# Altium project IOT_20232.PrjPcb
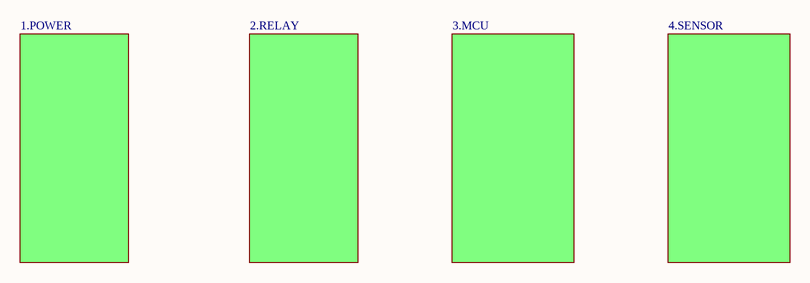
[diagram p0: GEN.SchDoc]
5 sheets, 63 parts. Net scope: global (net labels, ports and power ports of the same name join across sheets).
Board file: IOT.PcbDoc
Sheets:
  GEN.SchDoc
    Designator = 1.POWER.SchDoc
    Designator = 2.RELAY.SchDoc
    Designator = 3.MCU.SchDoc
    Designator = 4.SENSOR.SchDoc

## Sheet GEN.SchDoc
size A4; SheetNumber: 1; SheetTotal: 5

### Sub-sheets
Designator = 1.POWER: no entries
Designator = 2.RELAY: no entries
Designator = 3.MCU: no entries
Designator = 4.SENSOR: no entries

## Sheet 1.POWER.SchDoc
size A4; SheetNumber: 5; SheetTotal: 5
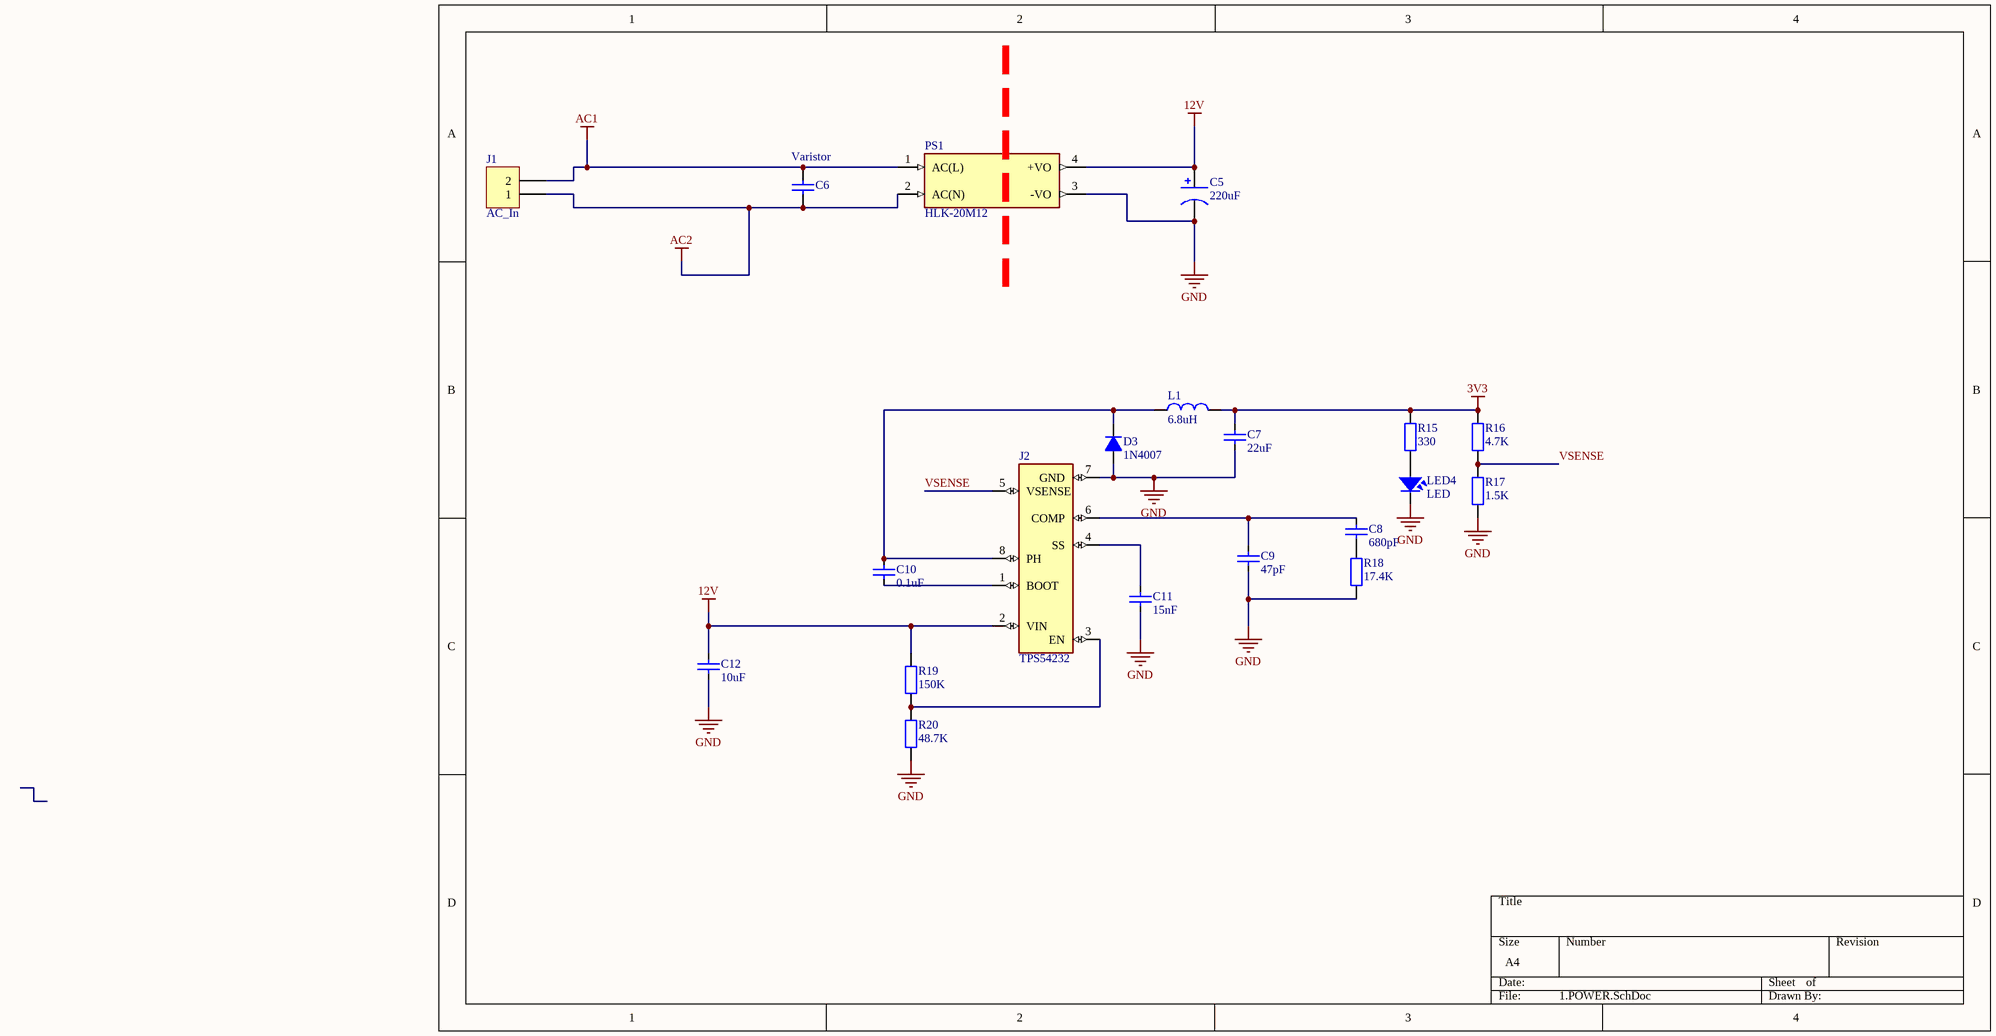
[diagram p1: 1.POWER.SchDoc]

### Parts
C5  220uF  [C3MM]
C6  Varistor  [CAP_CERAMIC]
C7  22uF  [CAP_0805]
C8  680pF  [CAP_0805]
C9  47pF  [CAP_0805]
C10  0.1uF  [CAP_0805]
C11  15nF  [CAP_0805]
C12  10uF  [CAP_0805]
D3  1N4007  [DIO-214AC(SMA)]
J1  AC_In  [KF2-5.08T]
J2  TPS54232  [SOIC8]
L1  6.8uH  [L-SMD-M-12x10]
LED4  LED  [LED_RED_SMD_0805]
PS1  HLK-20M12  [CONV_HLK-20M12]
R15  330  [RES-SMD-0805]
R16  4.7K  [RES-SMD-0805]
R17  1.5K  [RES-SMD-0805]
R18  17.4K  [RES-SMD-0805]
R19  150K  [RES-SMD-0805]
R20  48.7K  [RES-SMD-0805]

### Nets
3V3: C7.1 L1.2 R15.2 R16.2
12V: C5.1 C12.1 J2.2(VIN) PS1.4(+VO) R19.2
AC1: C6.1 J1.2 PS1.1(AC(L))  [project net COM1]
AC2: C6.2 J1.1 PS1.2(AC(N))
GND: C5.2 C7.2 C9.2 C11.2 C12.2 D3.1(A) J2.7(GND) LED4.2 PS1.3(-VO) R17.1 R18.1 R20.1
VSENSE: J2.5(VSENSE) R16.1 R17.2
NetC8_1: C8.1 C9.1 J2.6(COMP)
NetC8_2: C8.2 R18.2
NetC10_1: C10.1 D3.2(K) J2.8(PH) L1.1
NetC10_2: C10.2 J2.1(BOOT)
NetC11_1: C11.1 J2.4(SS)
NetJ2_3: J2.3(EN) R19.1 R20.2
NetLED4_1: LED4.1 R15.1

### Library data of the parts
C5 = Cap Pol: Polarized Capacitor (Axial); Published: 8-Jun-2000; LatestRevisionDate: 17-Jul-2002; LatestRevisionNote: Re-released for DXP Platform.; PackageReference: POLAR0.8; Publisher: Altium Limited
C6 = CapCeramic: Capacitor; Value: 33p; Published: 8-Jun-2000; LatestRevisionDate: 17-Jul-2002; LatestRevisionNote: Re-released for DXP Platform.; PackageReference: RAD-0.3; Publisher: Altium Limited
C7-C12 = CapSMD: Capacitor; Value: 33p; Published: 8-Jun-2000; LatestRevisionDate: 17-Jul-2002; LatestRevisionNote: Re-released for DXP Platform.; PackageReference: RAD-0.3; Publisher: Altium Limited
D3 = D1A: Diode 1A; Value: 1N4007
J1 = KF2: Manufacturer: Würth Elektronik eiSos GmbH; partNo: 691103110002; ComponentLink1 Description: Manufacturer; ComponentLink2 Description: Datasheet; NoPins: 2; Created Date: 29 October 2013; ComponentLink1URL: http://www.we-online.com; ComponentLink2URL: http://katalog.we-online.de/em/datasheet/6911031100xx.pdf; Created by: Karrer Zheng
J2 = TPS54232: Buck Switching Regulator IC Positive Adjustable 0.8V 1 Output 2A 8-SOIC (0.154, 3.90mm Width); MF: Texas Instruments; SnapEDA_Link: https://www.snapeda.com/parts/TPS54232/Texas+Instruments/view-part/?ref=snap; Package: - Texas Instruments; Value: *; MP: TPS54232; Check_prices: https://www.snapeda.com/parts/TPS54232/Texas+Instruments/view-part/?ref=eda
L1 = Inductor: Value: 150 mH
LED4 = LED: LED Single colour Green and Red; Value: LED 3 ly Single Colour
PS1 = HLK-20M12: 20W ultra-small series module power supply; MF: Hi-link; Check_prices: https://www.snapeda.com/parts/HLK-20M12/Hi-link/view-part/?ref=eda; SnapEDA_Link: https://www.snapeda.com/parts/HLK-20M12/Hi-link/view-part/?ref=snap; Availability: Not in stock; Price: None; Value: *; MP: HLK-20M12; Package: Non-Standard Hi-link
R15-R20 = Resistor - SMD: Resistor SMD; Manufacturer: Generic Components; Class: Passive; Published: 08/06/2000; Publisher: Altium Hobart Technology Centre

## Sheet 2.RELAY.SchDoc
size A4; SheetNumber: 2; SheetTotal: 5
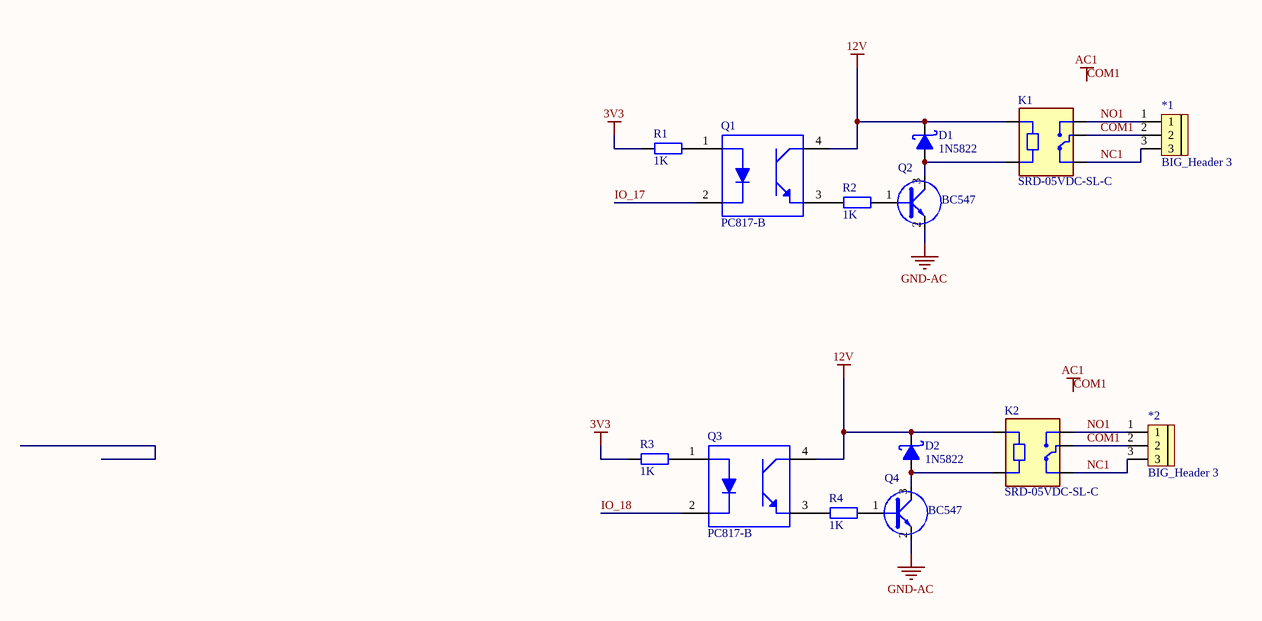
[diagram p2: 2.RELAY.SchDoc]

### Parts
*1  BIG_Header 3  [KF-128_3P]
*2  BIG_Header 3  [KF-128_3P]
D1  1N5822  [SMA]
D2  1N5822  [SMA]
K1  SRD-05VDC-SL-C  [RELAY_SRD-05VDC-SL-C]
K2  SRD-05VDC-SL-C  [RELAY_SRD-05VDC-SL-C]
Q1  PC817-B  [DIP762W50P254L650H455Q4B]
Q2  BC547  [TO-92]
Q3  PC817-B  [DIP762W50P254L650H455Q4B]
Q4  BC547  [TO-92]
R1  1K  [RES-SMD-0805]
R2  1K  [RES-SMD-0805]
R3  1K  [RES-SMD-0805]
R4  1K  [RES-SMD-0805]

### Nets
3V3: R1.2 R3.2
12V: D1.2(K) D2.2(K) K1.A1 K2.A1 Q1.4(COLLECTOR) Q3.4(COLLECTOR)
COM1: *1.2 *2.2 K1.COM K2.COM  [also labelled AC1]
GND-AC: Q2.2(E) Q4.2(E)
IO_17: Q1.2(CATHODE)
IO_18: Q3.2(CATHODE)
NC1: *1.3 *2.3 K1.NC K2.NC
NO1: *1.1 *2.1 K1.NO K2.NO
NetD1_1: D1.1(A) K1.A2 Q2.3(C)
NetD2_1: D2.1(A) K2.A2 Q4.3(C)
NetQ1_1: Q1.1(ANODE) R1.1
NetQ1_3: Q1.3(EMITTER) R2.2
NetQ2_1: Q2.1(B) R2.1
NetQ3_1: Q3.1(ANODE) R3.1
NetQ3_3: Q3.3(EMITTER) R4.2
NetQ4_1: Q4.1(B) R4.1

### Library data of the parts
D1 D2 = 1N5822: Schottky Rectifiers; Value: Diode c?m 1N5408
K1 K2 = SRD-05VDC-SL-C: https://linhkien.cxt.vn/3210-sra-12vdc-cl-songle-relay-20a-12vdc-5-chan.html; MF: Songle Relay; Check_prices: https://www.snapeda.com/parts/SRD-05VDC-SL-C/Songle+Relay/view-part/?ref=eda; Value: *; Availability: Not in stock; Price: None; Package: NON STANDARD-5 Songle Relay; MP: SRD-05VDC-SL-C; SnapEDA_Link: https://www.snapeda.com/parts/SRD-05VDC-SL-C/Songle+Relay/view-part/?ref=snap
Q1 Q3 = PC817-B: Phototransistors 4-DIP _0.300, 7.62mm_; MF: American Bright; SnapEDA_Link: https://www.snapeda.com/parts/PC817-B/American%20Bright/view-part/524587/?ref=snap; Availability: Unavailable; MP: PC817-B; Value: *; Price: None; Package: DIP-4 American Bright
Q2 Q4 = C1815: NPN 600mW, ECB; Value: C1815
R1-R4 = Resistor - SMD: as R15 on sheet 1.POWER; Published: 08/06/2000; Publisher: Altium Hobart Technology Centre

## Sheet 3.MCU.SchDoc
size A4; SheetNumber: 3; SheetTotal: 5
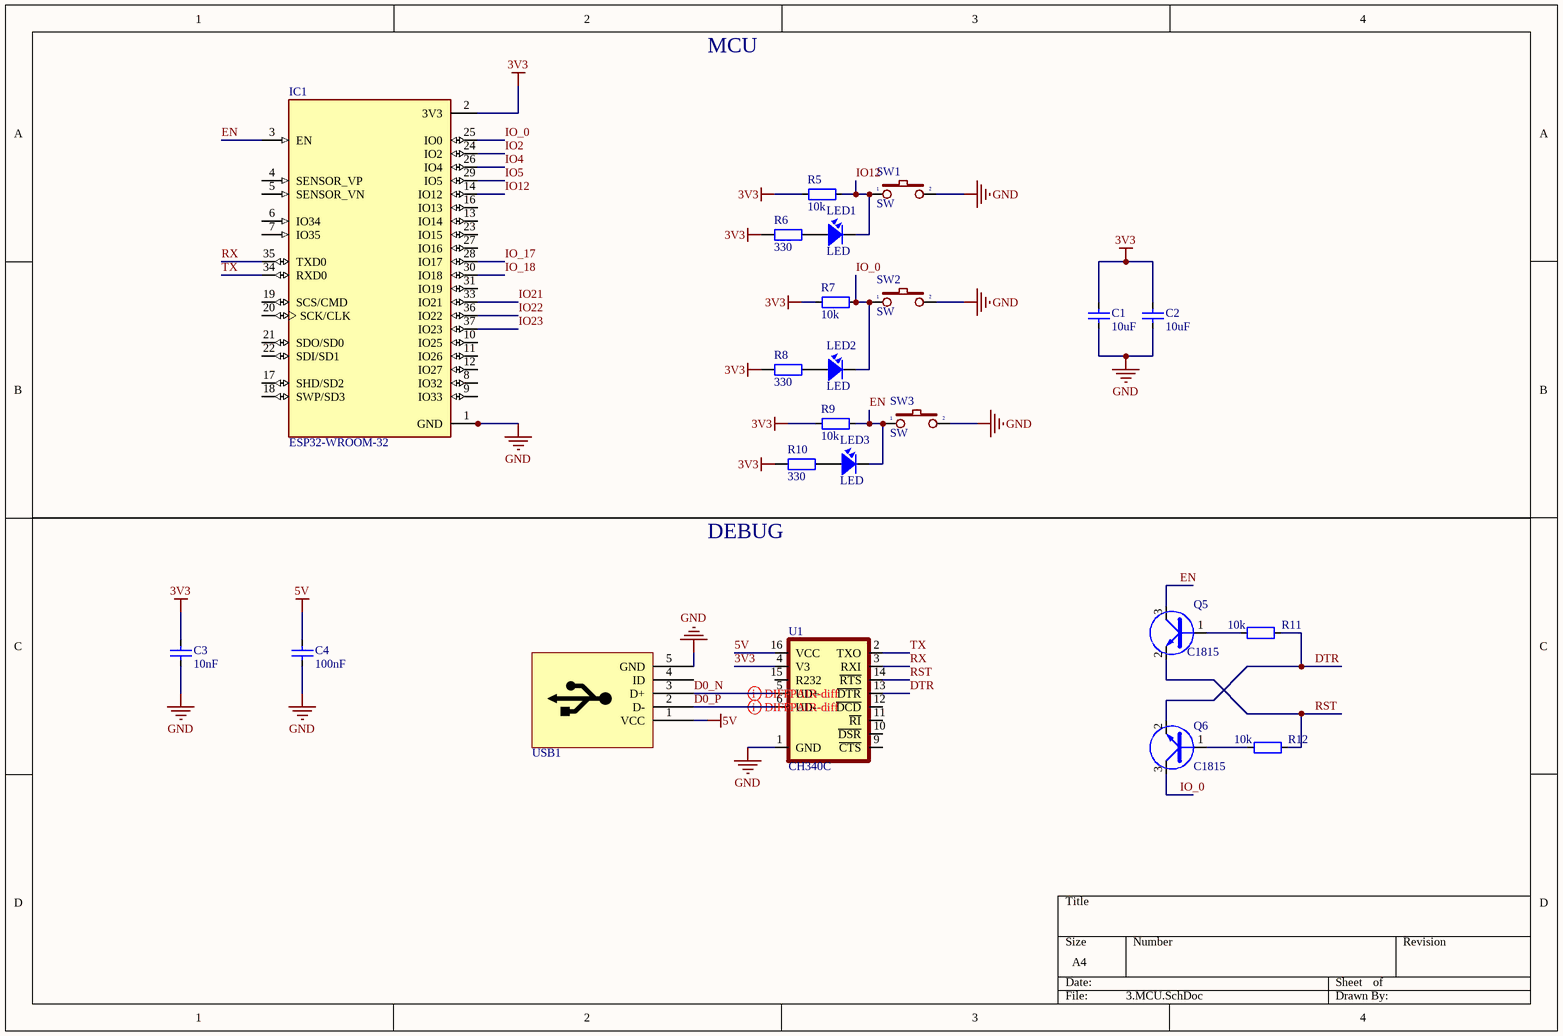
[diagram p3: 3.MCU.SchDoc]

### Parts
C1  10uF  [CAP_0805]
C2  10uF  [CAP_0805]
C3  10nF  [CAP_0805]
C4  100nF  [CAP_0805]
IC1  ESP32-WROOM-32  [MODULE_ESP32-WROOM-32]
LED1  LED  [LED-0805-Blue]
LED2  LED  [LED-0805-Blue]
LED3  LED  [LED-0805-Blue]
Q5  C1815  [SOT23D]
Q6  C1815  [SOT23D]
R5  10k  [RES-SMD-0805]
R6  330  [RES-SMD-0805]
R7  10k  [RES-SMD-0805]
R8  330  [RES-SMD-0805]
R9  10k  [RES-SMD-0805]
R10  330  [RES-SMD-0805]
R11  10k  [RES-SMD-0805]
R12  10k  [RES-SMD-0805]
SW1  SW  [SW2]
SW2  SW  [SW2]
SW3  SW  [SW2]
U1  CH340C  [SOP-16]
USB1  USB  [USB-M1]  (value not drawn)

### Nets
3V3: C1.1 C2.1 C3.1 IC1.2(3V3) R5.2 R6.2 R7.2 R8.2 R9.2 R10.2 U1.4(V3)
5V: C4.1 U1.16(VCC) USB1.1(VCC)
GND: C1.2 C2.2 C3.2 C4.2 IC1.1(GND) IC1.15(GND) IC1.38(GND) IC1.39_1(GND) IC1.39_2(GND) IC1.39_3(GND) IC1.39_4(GND) IC1.39_5(GND) IC1.39_6(GND) IC1.39_7(GND) IC1.39_8(GND) IC1.39_9(GND) IC1.39_10(GND) IC1.39_11(GND) IC1.39_12(GND) IC1.39_13(GND) IC1.39_14(GND) IC1.39_15(GND) IC1.39_16(GND) IC1.39_17(GND) IC1.39_18(GND) IC1.39_19(GND) IC1.39_20(GND) IC1.39_21(GND) SW1.2 SW2.2 SW3.2 U1.1(GND) USB1.5(GND)
D0_N: U1.5(UD+) USB1.3(D+)
D0_P: U1.6(UD-) USB1.2(D-)
DTR: Q6.2(E) R11.1 U1.13(~{DTR})
EN: IC1.3(EN) LED3.2 Q5.3(C) R9.1 SW3.1
IO2: IC1.24(IO2)
IO4: IC1.26(IO4)
IO5: IC1.29(IO5)
IO12: IC1.14(IO12) LED1.2 R5.1 SW1.1
IO21: IC1.33(IO21)
IO22: IC1.36(IO22)
IO23: IC1.37(IO23)
IO_0: IC1.25(IO0) LED2.2 Q6.3(C) R7.1 SW2.1
IO_17: IC1.28(IO17)
IO_18: IC1.30(IO18)
RST: Q5.2(E) R12.1 U1.14(~{RTS})
RX: IC1.35(TXD0) U1.3(RXI)
TX: IC1.34(RXD0) U1.2(TXO)
NetLED1_1: LED1.1 R6.1
NetLED2_1: LED2.1 R8.1
NetLED3_1: LED3.1 R10.1
NetQ5_1: Q5.1(B) R11.2
NetQ6_1: Q6.1(B) R12.2

Not connected (* = marked no-connect by the designer): IC1 4(SENSOR_VP) 5(SENSOR_VN) 6(IO34) 7(IO35) 8(IO32) 9(IO33) 10(IO25) 11(IO26) 12(IO27) 13(IO14) 16(IO13) 17(SHD/SD2) 18(SWP/SD3) 19(SCS/CMD) 20(SCK/CLK) 21(SDO/SD0) 22(SDI/SD1) 23(IO15) 27(IO16) 31(IO19); U1 9(~{CTS}) 10(~{DSR}) 11(~{RI}) 12(~{DCD}) 15(R232); USB1 4(ID)

### Layout directives
differential pair; differential pair class diff: D0_N, D0_P

### Notes on the sheet
- MCU
- DEBUG

### Library data of the parts
C1-C4 = CapSMD: Capacitor; Value: 33p; Published: 8-Jun-2000; LatestRevisionDate: 17-Jul-2002; LatestRevisionNote: Re-released for DXP Platform.; PackageReference: RAD-0.3; Publisher: Altium Limited
IC1 = ESP32-WROOM-32: Bluetooth, WiFi Transceiver Module 2.4GHz ~ 2.5GHz Surface Mount; MF: Espressif Systems; Package: Module Espressif Systems; Digi-Key_Part_Number: 1904-1010-1-ND; Digi-Key_Purchase_URL: https://www.digikey.com/product-detail/en/espressif-systems/ESP32-WROOM-32/1904-1010-1-ND/8544305?utm_source=snapeda&utm_medium=aggregator&utm_campaign=symbol; Value: *; MP: ESP32-WROOM-32; SnapEDA_Link: https://www.snapeda.com/parts/ESP32-WROOM-32/Espressif%20Systems/view-part/2753322/?ref=snap
LED1-LED3 = LED: as LED4 on sheet 1.POWER
Q5 Q6 = 2SC1815: NPN 600mW, ECB; Value: C1815
R5 R7 R9 R11 R12 = Resistor - SMD: Resistor; Manufacturer: Generic Components; Class: Passive; Published: 08/06/2000; Publisher: Altium Hobart Technology Centre
R6 R8 R10 = Resistor - SMD: as R15 on sheet 1.POWER; Published: 08/06/2000; Publisher: Altium Hobart Technology Centre
SW1-SW3 = SW2: Switch button 2 pin; Value: SW chip 2 pin
U1 = CH340C: USB to serial chip CH340; MF: WCH; Package: Package; Check_prices: https://www.snapeda.com/parts/CH340C/WCH/view-part/5428851/?ref=eda; Value: *; Price: None; MP: CH340C; Availability: Unavailable; SnapEDA_Link: https://www.snapeda.com/parts/CH340C/WCH/view-part/5428851/?ref=snap
USB1 = USB-M

## Sheet 4.SENSOR.SchDoc
size A4; SheetNumber: 4; SheetTotal: 5
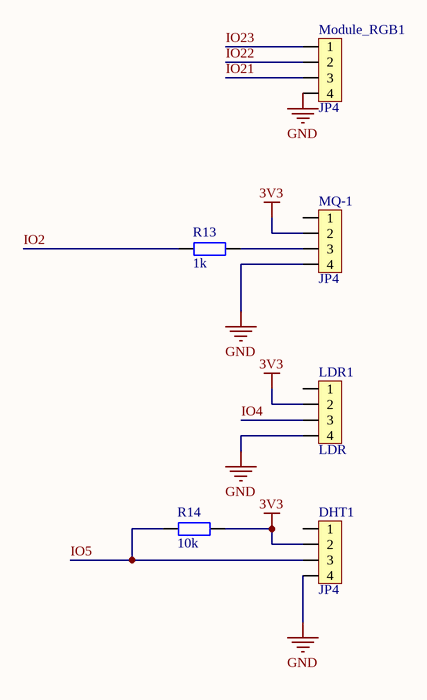
[diagram p4: 4.SENSOR.SchDoc]

### Parts
DHT1  JP4  [JP4-C1T]
LDR1  LDR  [JP4-C1T]
Module_RGB1  JP4  [JP4-C1T]
MQ-1  JP4  [JP4-C1T]
R13  1k  [RES-SMD-0805]
R14  10k  [RES-SMD-0805]

### Nets
3V3: DHT1.2 LDR1.2 MQ-1.2 R14.1
GND: DHT1.4 LDR1.4 Module_RGB1.4 MQ-1.4
IO2: R13.2
IO4: LDR1.3
IO5: DHT1.3 R14.2
IO21: Module_RGB1.3
IO22: Module_RGB1.2
IO23: Module_RGB1.1
NetMQ-1_3: MQ-1.3 R13.1

Not connected (* = marked no-connect by the designer): DHT1 1; LDR1 1; MQ-1 1

### Library data of the parts
DHT1 LDR1 Module_RGB1 MQ-1 = JP4: WR-PHD 2.54 mm Angled Socket Header; Manufacturer: W¨¹rth Elektronik eiSos GmbH; partNo: 613004143121; ComponentLink1 Description: Manufacturer; ComponentLink2 Description: Datasheet; NoPins: 04; Created Date: 29 March 2013; ComponentLink1URL: http://www.we-online.com; ComponentLink2URL: http://katalog.we-online.de/em/datasheet/6130xx143121.pdf; Created by: Karrer Zheng
R13 = Resistor - SMD: Manufacturer: Generic Components; Class: Passive; Published: 08/06/2000; Publisher: Altium Hobart Technology Centre
R14 = Resistor - SMD: 1k; Manufacturer: Generic Components; Class: Passive; Published: 08/06/2000; Publisher: Altium Hobart Technology Centre

## Nets that join several sheets
3V3: 1.POWER (C7.1 L1.2 R15.2 R16.2), 2.RELAY (R1.2 R3.2), 3.MCU (11 pins), 4.SENSOR (DHT1.2 LDR1.2 MQ-1.2 R14.1)
12V: 1.POWER (5 pins), 2.RELAY (6 pins)
COM1: 1.POWER (C6.1 J1.2 PS1.1), 2.RELAY (*1.2 *2.2 K1.COM K2.COM)
GND: 1.POWER (12 pins), 3.MCU (33 pins), 4.SENSOR (DHT1.4 LDR1.4 Module_RGB1.4 MQ-1.4)
IO2: 3.MCU (IC1.24), 4.SENSOR (R13.2)
IO4: 3.MCU (IC1.26), 4.SENSOR (LDR1.3)
IO5: 3.MCU (IC1.29), 4.SENSOR (DHT1.3 R14.2)
IO21: 3.MCU (IC1.33), 4.SENSOR (Module_RGB1.3)
IO22: 3.MCU (IC1.36), 4.SENSOR (Module_RGB1.2)
IO23: 3.MCU (IC1.37), 4.SENSOR (Module_RGB1.1)
IO_17: 2.RELAY (Q1.2), 3.MCU (IC1.28)
IO_18: 2.RELAY (Q3.2), 3.MCU (IC1.30)